# EAGLE design CCM_0011 (EAGLE 8.6.0)

## Sheet 1 of 4: stage A
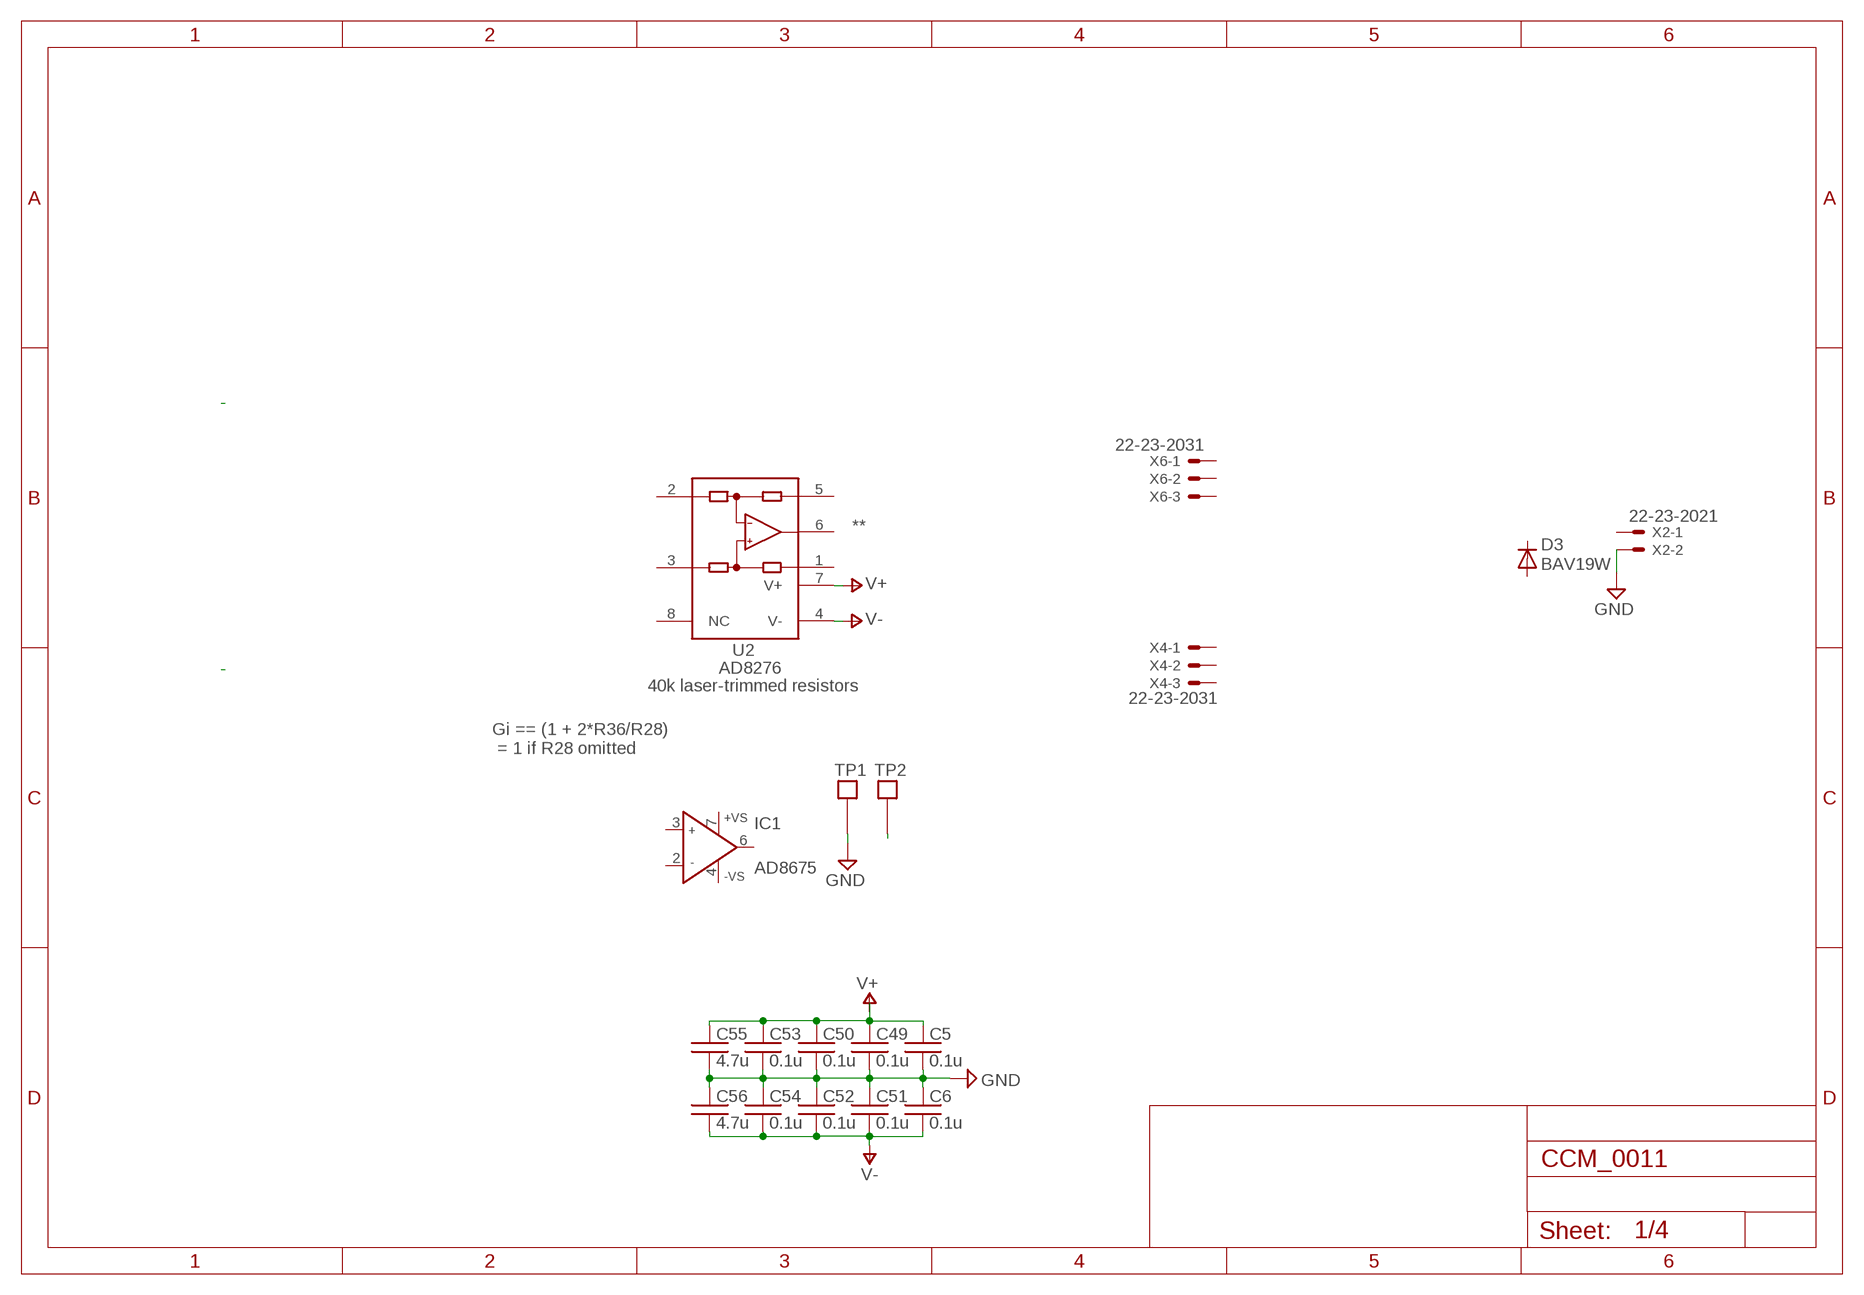
[diagram p0: schematic, sheet 1]

### Parts
C5  0.1u  C0603  [0603]
C6  0.1u  C0603  [0603]
C49  0.1u  C0603  [0603]
C50  0.1u  C0603  [0603]
C51  0.1u  C0603  [0603]
C52  0.1u  C0603  [0603]
C53  0.1u  C0603  [0603]
C54  0.1u  C0603  [0603]
C55  4.7u  C0603  [0603]
C56  4.7u  C0603  [0603]
D3  BAV19W  DIODE-SOD123  [SOD123]
IC1  AD8675  AD825_A  [SO08]
TP1  TESTPOINT  [TESTPOINT]
TP2  TESTPOINT  [TESTPOINT]
U2  AD8276  [SO8]
X2  22-23-2021  [22-23-2021]
X4  22-23-2031  [22-23-2031]
X6  22-23-2031  [22-23-2031]

### Nets
GND: C5.2 C6.1 C49.2 C50.2 C51.1 C52.1 C53.2 C54.1 C55.2 C56.1 TP1.P$1 X2.2 ; also sheet 2,4
N$7: TP2.P$1
V+: C5.1 C49.1 C50.1 C53.1 C55.1 U2.7(V+) ; also sheet 2,3
V-: C6.2 C51.2 C52.2 C54.2 C56.2 U2.4(V-) ; also sheet 2,3
Unconnected: D3.A D3.C IC1.2(IN-) IC1.3(IN+) IC1.4(-VS) IC1.6(OUT) IC1.7(+VS) U2.1(REF) U2.2(-IN) U2.3(+IN) U2.5(SENSE) U2.6(OUT) U2.8(NC) X2.1 X4.1 X4.2 X4.3 X6.1 X6.2 X6.3

### Notes on the sheet
- **
- 40k laser-trimmed resistors
- Gi == (1 + 2*R36/R28)
   = 1 if R28 omitted

## Sheet 2 of 4: triangle wave generation
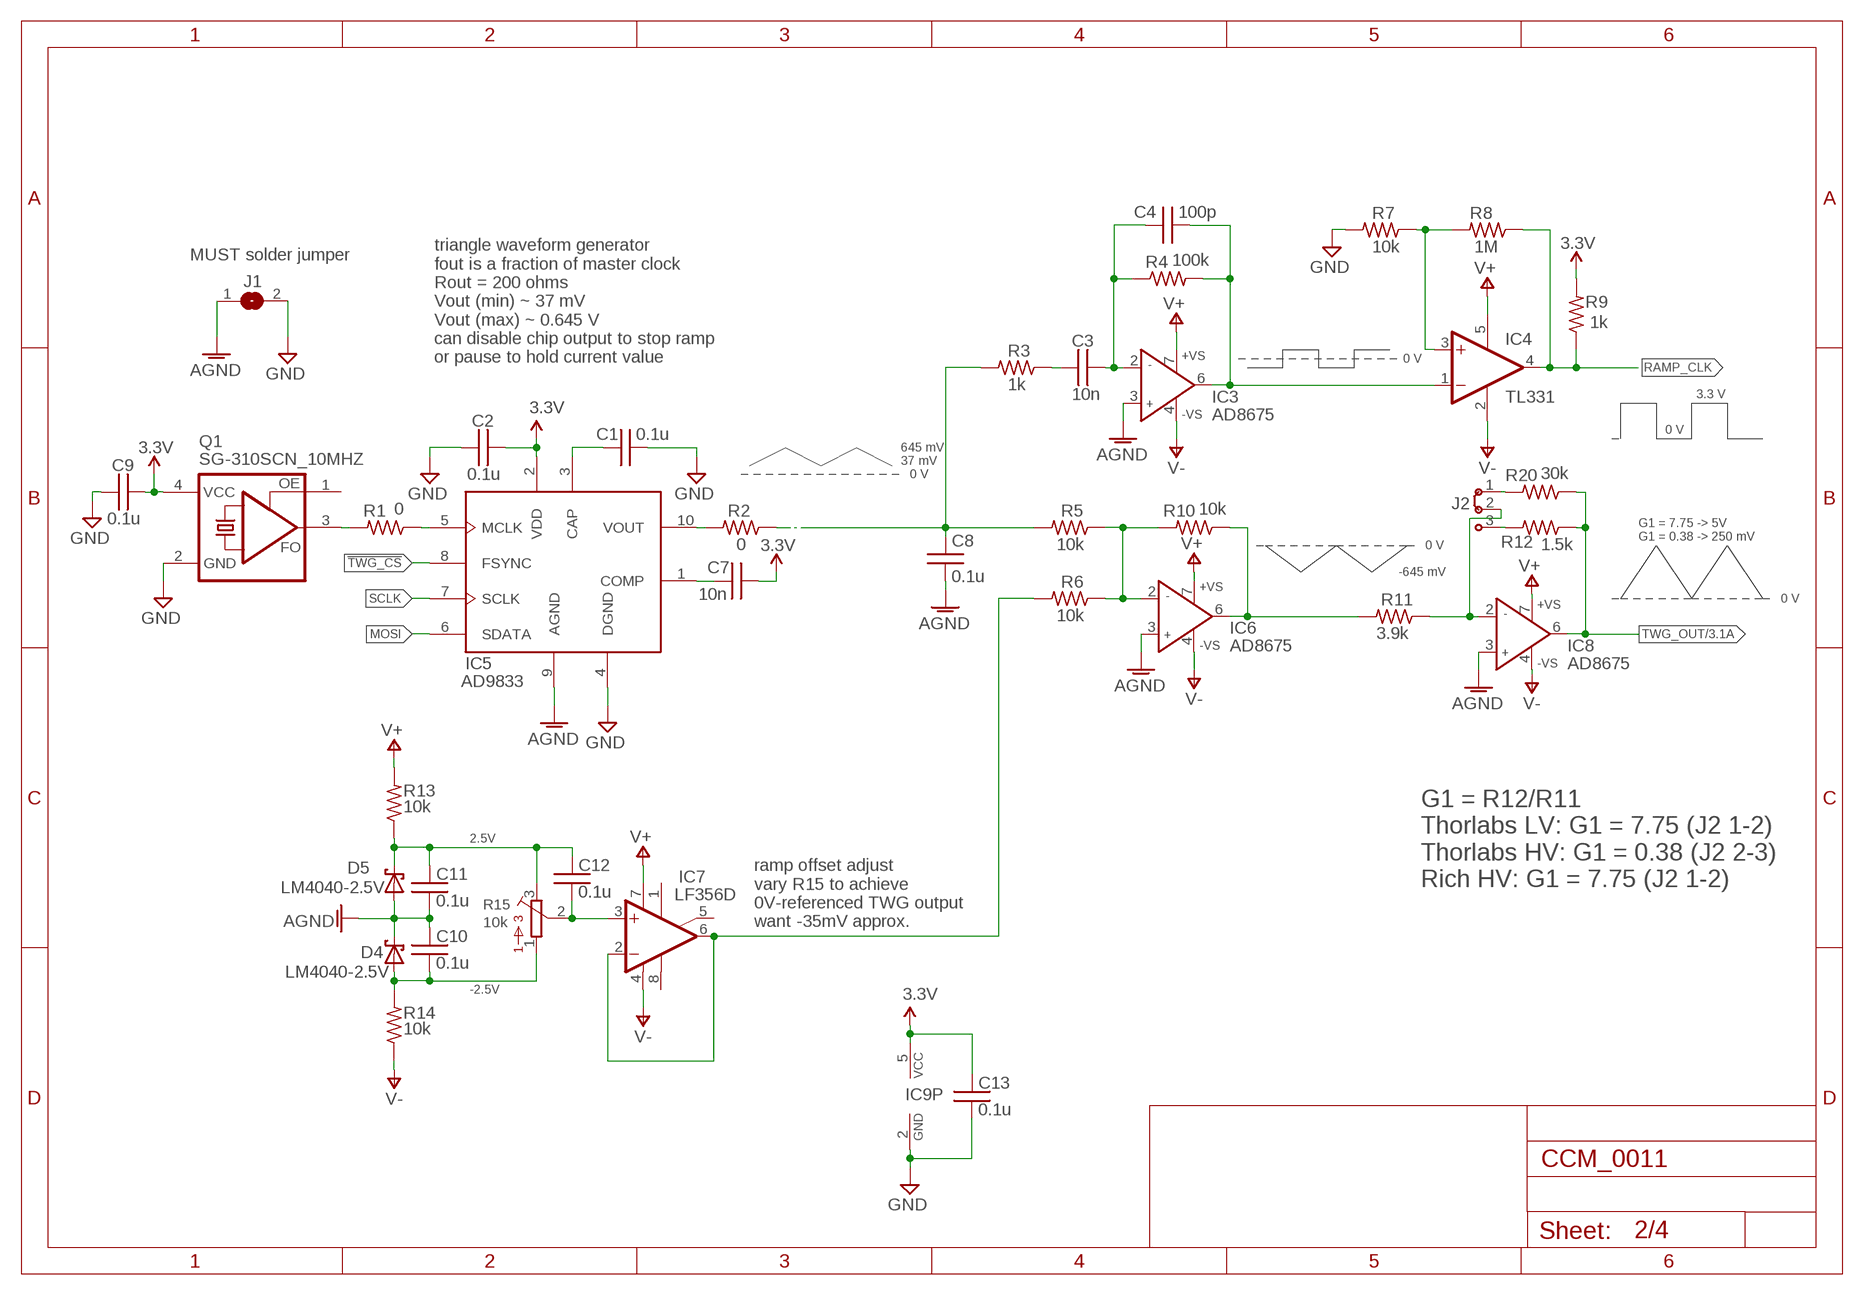
[diagram p1: schematic, sheet 2]

### Parts
C1  0.1u  C0603  [0603]
C2  0.1u  C0603  [0603]
C3  10n  C0603  [0603]
C4  100p  C0603  [0603]
C7  10n  C0603  [0603]
C8  0.1u  C0603  [0603]
C9  0.1u  C0603  [0603]
C10  0.1u  C0603  [0603]
C11  0.1u  C0603  [0603]
C12  0.1u  C0603  [0603]
C13  0.1u  C0603  [0603]
D4  LM4040-2.5V  LM4040  [SOT23]
D5  LM4040-2.5V  LM4040  [SOT23]
IC3  AD8675  AD825_BR  [SO8]
IC4  TL331  [DBV-R-PDSO-G5]
IC5  AD9833  AD9833/7  [MSOP10]
IC6  AD8675  AD825_BR  [SO8]
IC7  LF356D  [SO08]
IC8  AD8675  AD825_BR  [SO8]
IC9  741G3157DBVR  [DBV_R-PDSO-G6]
J1  SJ  [SJ]
J2  J2X2MM  [04C]
Q1  SG-310SCN_10MHZ  ASF1  [ASF]
R1  0  R0603  [0603]
R2  0  R0603  [0603]
R3  1k  R0603  [0603]
R4  100k  R0603  [0603]
R5  10k  R0603  [0603]
R6  10k  R0603  [0603]
R7  10k  R0603  [0603]
R8  1M  R0603  [0603]
R9  1k  R0603  [0603]
R10  10k  R0603  [0603]
R11  3.9k  R0603  [0603]
R12  1.5k  R0603  [0603]
R13  10k  R0603  [0603]
R14  10k  R0603  [0603]
R15  10k  3386-H  [3386H]
R20  30k  R0603  [0603]

### Nets
3.3V: C2.1 C7.1 C9.1 C13.1 IC5.2(VDD) IC9.5(VCC) Q1.4(VCC) R9.2 ; also sheet 4
!TWG_CS: IC5.8(FSYNC)
AGND: C8.2 C10.1 C11.2 D4.1(C) D5.2(A) IC3.3(IN+) IC5.9(AGND) IC6.3(IN+) IC8.3(IN+) J1.1 ; also sheet 3,4
GND: C1.1 C2.2 C9.2 C13.2 IC5.4(DGND) IC9.2(GND) J1.2 Q1.2(GND) R7.2 ; also sheet 1,4
MOSI: IC5.6(SDATA)
N$3: IC5.10(VOUT) R2.2
N$6: IC4.3(+IN) R7.1 R8.2
N$9: C1.2 IC5.3(CAP)
N$10: C3.1 R3.1
N$11: C3.2 C4.2 IC3.2(IN-) R4.1
N$12: C4.1 IC3.6(OUT) IC4.1(-IN) R4.2
N$13: C10.2 D4.2(A) R14.2 R15.1
N$14: C12.2 IC7.3(+IN) R15.2
N$15: IC7.2(-IN) IC7.6(OUT) R6.2
N$16: IC6.2(IN-) R5.1 R6.1 R10.2
N$17: IC8.2(IN-) J2.2 R11.1
N$18: C11.1 C12.1 D5.1(C) R13.1 R15.3
N$19: IC6.6(OUT) R10.1 R11.2
N$23: Q1.3(FO) R1.2
N$24: C7.2 IC5.1(COMP)
N$26: IC5.5(MCLK) R1.1
N$28: J2.1 R20.2
N$29: J2.3 R12.2
RAMP_CLK: IC4.4(OUT) R8.1 R9.1
SCLK: IC5.7(SCLK)
TWG_OUT: IC8.6(OUT) R12.1 R20.1 ; also sheet 3
TWG_RAW: C8.1 R2.1 R3.2 R5.2
V+: IC3.7(+VS) IC4.5(V+) IC6.7(+VS) IC7.7(V+) IC8.7(+VS) R13.2 ; also sheet 1,3
V-: IC3.4(-VS) IC4.2(GND) IC6.4(-VS) IC7.4(V-) IC8.4(-VS) R14.1 ; also sheet 1,3
Unconnected: IC7.1(ON1) IC7.5(ON2) IC7.8(OPT) IC9.1(B) IC9.3(A) IC9.4(X) IC9.6(!A!/B) Q1.1(OE)

### Notes on the sheet
- MUST solder jumper
- triangle waveform generator
  fout is a fraction of master clock
  Rout = 200 ohms
  Vout (min) ~ 37 mV
  Vout (max) ~ 0.645 V
  can disable chip output to stop ramp
  or pause to hold current value
- 0 V
- 3.3 V
- 0 V
- 645 mV
- 37 mV
- 0 V
- G1 = 7.75 -> 5V
  G1 = 0.38 -> 250 mV
- 0 V
- -645 mV
- 0 V
- 2.5V
- G1 = R12/R11
  Thorlabs LV: G1 = 7.75 (J2 1-2)
  Thorlabs HV: G1 = 0.38 (J2 2-3)
  Rich HV: G1 = 7.75 (J2 1-2)
- ramp offset adjust
  vary R15 to achieve 
  0V-referenced TWG output
  want -35mV approx.
- -2.5V

## Sheet 3 of 4: cavity drive
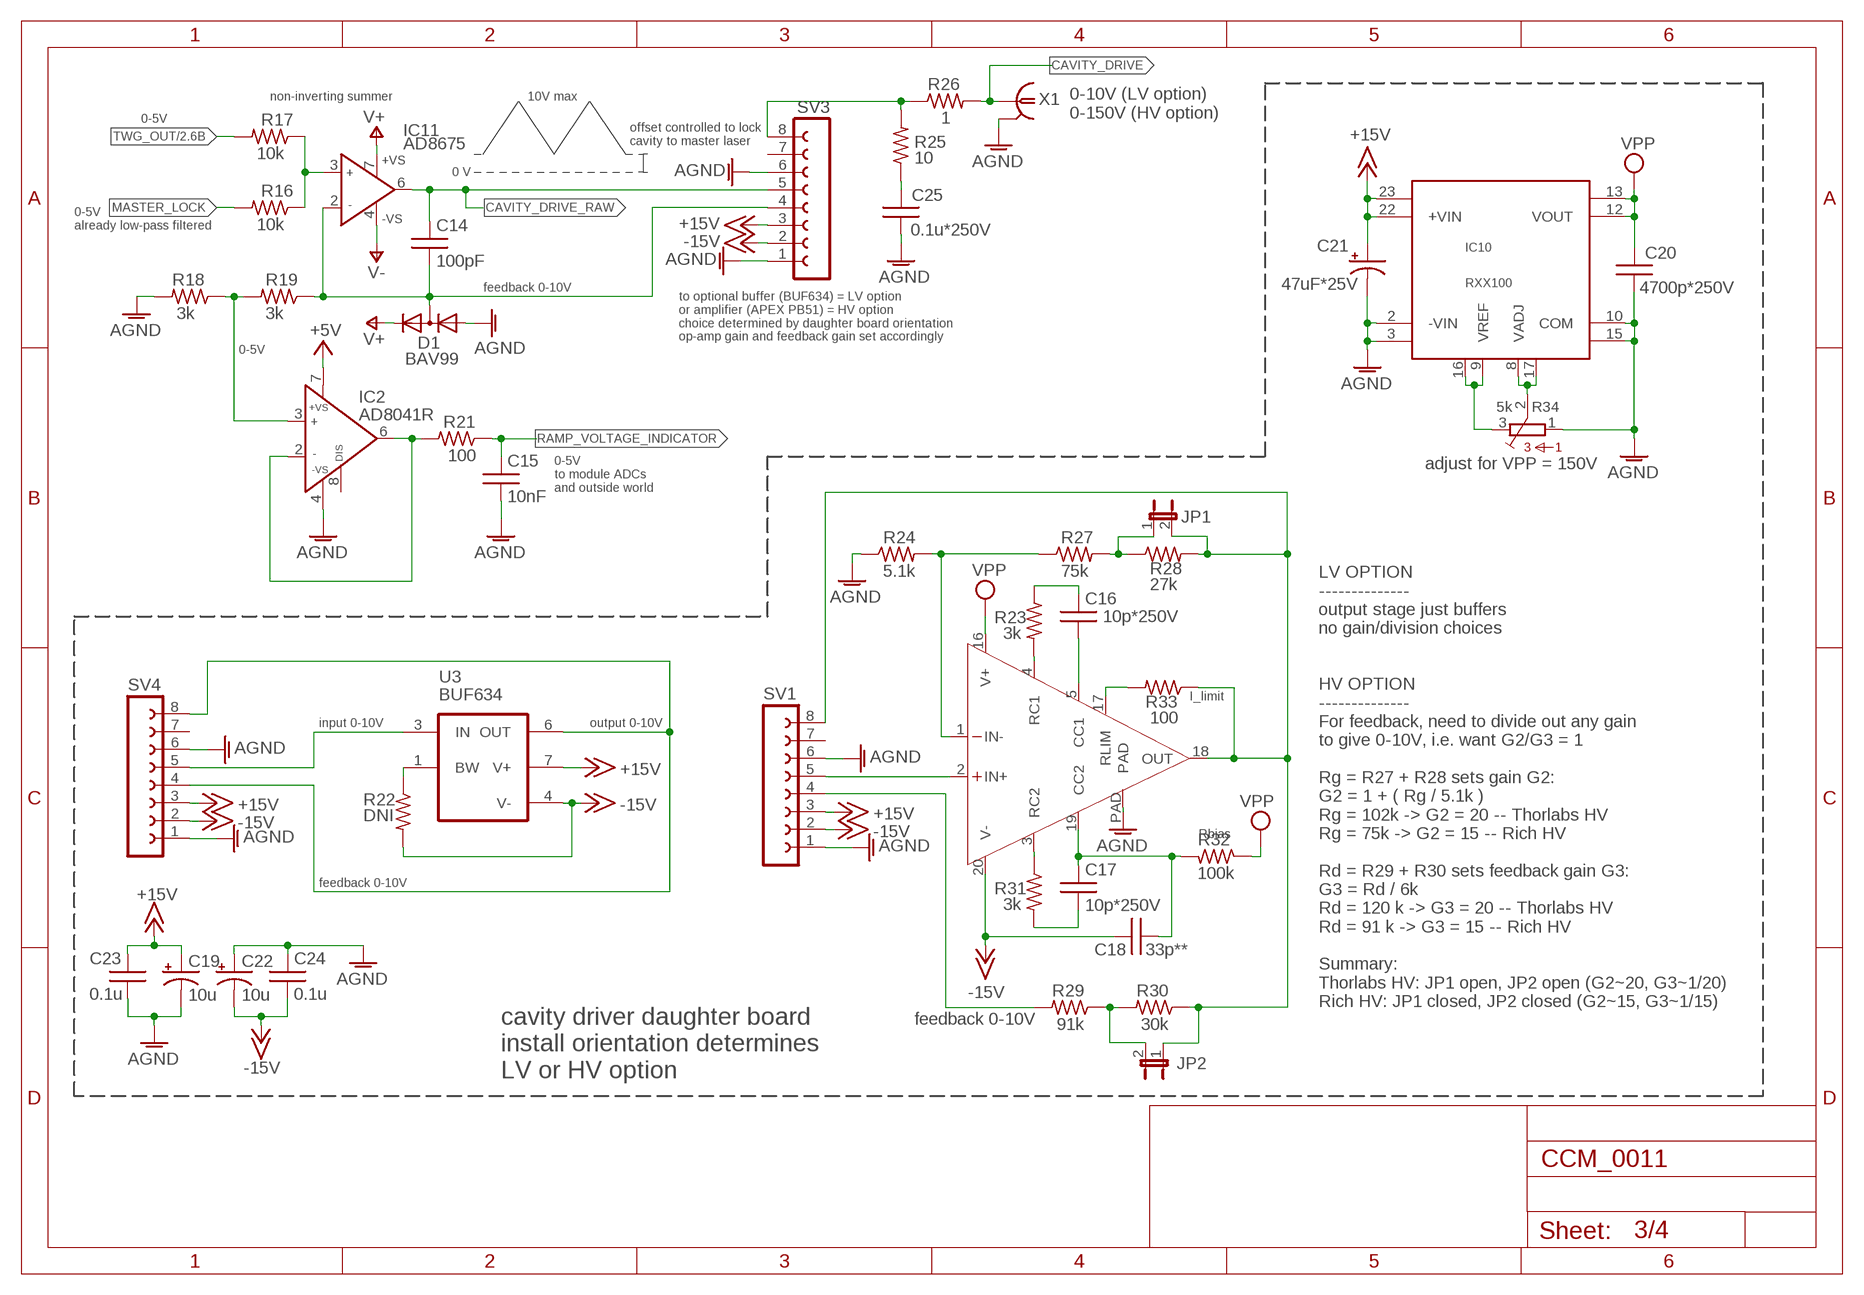
[diagram p2: schematic, sheet 3]

### Parts
C14  100pF  C0603  [0603]
C15  10nF  C0603  [0603]
C16  10p*250V  C0603  [0603]
C17  10p*250V  C0603  [0603]
C18  33p**  C0603  [0603]
C19  10u  CAP_POL1206  [EIA3216]
C20  4700p*250V  CAPACITOR1210  [1210]
C21  47uF*25V  CAP_POL7343  [EIA7343]
C22  10u  CAP_POL1206  [EIA3216]
C23  0.1u  C0603  [0603]
C24  0.1u  C0603  [0603]
C25  0.1u*250V  CAPACITOR1210  [1210]
D1  BAV99  [SOT23]
IC2  AD8041R  [SO8]
IC10  RXX100  [RXXDIP]
IC11  AD8675  AD825_A  [SO08]
JP1  JP1E  [JP1]
JP2  JP1E  [JP1]
R16  10k  R0603  [0603]
R17  10k  R0603  [0603]
R18  3k  R0603  [0603]
R19  3k  R0603  [0603]
R21  100  R0603  [0603]
R22  DNI  R0603  [0603]
R23  3k  R0603  [0603]
R24  5.1k  R0603  [0603]
R25  10  RESISTOR2512  [2512]
R26  1  RESISTOR2512  [2512]
R27  75k  R0603  [0603]
R28  27k  R0603  [0603]
R29  91k  R0603  [0603]
R30  30k  R0603  [0603]
R31  3k  R0603  [0603]
R32  100k  R0603  [0603]
R33  100  R0603  [0603]
R34  5k  3386-H  [3386H]
SV1  FE08W  [FE08W]
SV3  FE08-1  [FE08]
SV4  FE08W  [FE08W]
U3  BUF634  [SO8]
U$1  PA78  [PSOP-20]
X1  1-227161-0  [AMP_227161]

### Nets
+5V: IC2.7(+VS) ; also sheet 4
+15V: C19.A(+) C21.A(+) C23.1 IC10.22(+VIN) IC10.23(VIN2+) SV1.3 SV3.3 SV4.3 U3.7(V+)
-15V: C18.2 C22.C(-) C24.2 R22.2 SV1.2 SV3.2 SV4.2 U3.4(V-) U$1.20(V-)
AGND: C15.2 C19.C(-) C20.2 C21.C(-) C22.A(+) C23.2 C24.1 C25.2 D1.1(A) IC2.4(-VS) IC10.2(-VIN) IC10.3(VIN2-) IC10.10(COM) IC10.15(COM2) R18.2 R24.1 R34.1 SV1.1 SV1.6 SV3.1 SV3.6 SV4.1 SV4.6 U$1.PAD X1.2 ; also sheet 2,4
CAVITY_DRIVE: R26.2 X1.1
CAVITY_DRIVE_RAW: C14.1 IC11.6(OUT) SV3.5
MASTER_LOCK: R16.2
N$2: SV4.5 U3.3(IN)
N$5: IC2.3(IN+) R18.1 R19.2
N$8: JP2.2 R29.1 R30.2
N$20: C14.2 D1.3(AC) IC11.2(IN-) R19.1 SV3.4
N$21: IC11.3(IN+) R16.1 R17.1
N$22: R22.1 U3.1(BW)
N$25: SV4.4 SV4.8 U3.6(OUT)
N$27: SV1.5 U$1.2(IN+)
N$30: IC2.2(IN-) IC2.6(OUT) R21.2
N$31: C16.1 R23.1
N$32: JP1.2 JP2.1 R28.2 R30.1 R33.1 SV1.8 U$1.18(OUT)
N$33: R25.2 R26.1 SV3.8
N$34: C25.1 R25.1
N$35: R33.2 U$1.17(RLIM)
N$36: JP1.1 R27.2 R28.1
N$37: R23.2 U$1.4(RC1)
N$38: R24.2 R27.1 U$1.1(IN-)
N$39: C16.2 U$1.5(CC1)
N$40: R29.2 SV1.4
N$42: R31.1 U$1.3(RC2)
N$43: C17.1 C18.1 R32.2 U$1.19(CC2)
N$44: C17.2 R31.2
N$45: IC10.9(VREF) IC10.16(VREF2) R34.3
N$46: IC10.8(VADJ) IC10.17(VADJ2) R34.2
RAMP_VOLTAGE_INDICATOR: C15.1 R21.1
TWG_OUT: R17.2 ; also sheet 2
V+: D1.2(C) IC11.7(+VS) ; also sheet 1,2
V-: IC11.4(-VS) ; also sheet 1,2
VOUT2: C20.1 IC10.12(VOUT) IC10.13(VOUT2) ; supply symbol labelled VPP
VPP: R32.1 U$1.16(V+)
Unconnected: IC2.8(DISABLE) SV1.7 SV3.7 SV4.7

### Notes on the sheet
- non-inverting summer | 10V max
- 0-10V (LV option)
  0-150V (HV option)
- 0-5V
- offset controlled to lock 
  cavity to master laser
- 0 V
- 0-5V
  already low-pass filtered
- feedback 0-10V
- to optional buffer (BUF634) = LV option
  or amplifier (APEX PB51) = HV option
  choice determined by daughter board orientation
  op-amp gain and feedback gain set accordingly
- 0-5V
- adjust for VPP = 150V
- 0-5V
  to module ADCs
  and outside world
- I_limit
- input 0-10V | output 0-10V
- Rbias
- feedback 0-10V
- LV OPTION
  --------------
  output stage just buffers
  no gain/division choices
  
  
  HV OPTION
  --------------
  For feedback, need to divide out any gain
  to give 0-10V, i.e. want G2/G3 = 1
  
  Rg = R27 + R28 sets gain G2: 
  G2 = 1 + ( Rg / 5.1k )
  Rg = 102k -> G2 = 20 -- Thorlabs HV
  Rg = 75k -> G2 = 15 -- Rich HV
  
  Rd = R29 + R30 sets feedback gain G3:
  G3 = Rd / 6k
  Rd = 120 k -> G3 = 20 -- Thorlabs HV
  Rd = 91 k -> G3 = 15 -- Rich HV
  
  Summary:
  Thorlabs HV: JP1 open, JP2 open (G2~20, G3~1/20)
  Rich HV: JP1 closed, JP2 closed (G2~15, G3~1/15)
- feedback 0-10V
- cavity driver daughter board
  install orientation determines
  LV or HV option

## Sheet 4 of 4: master input stage
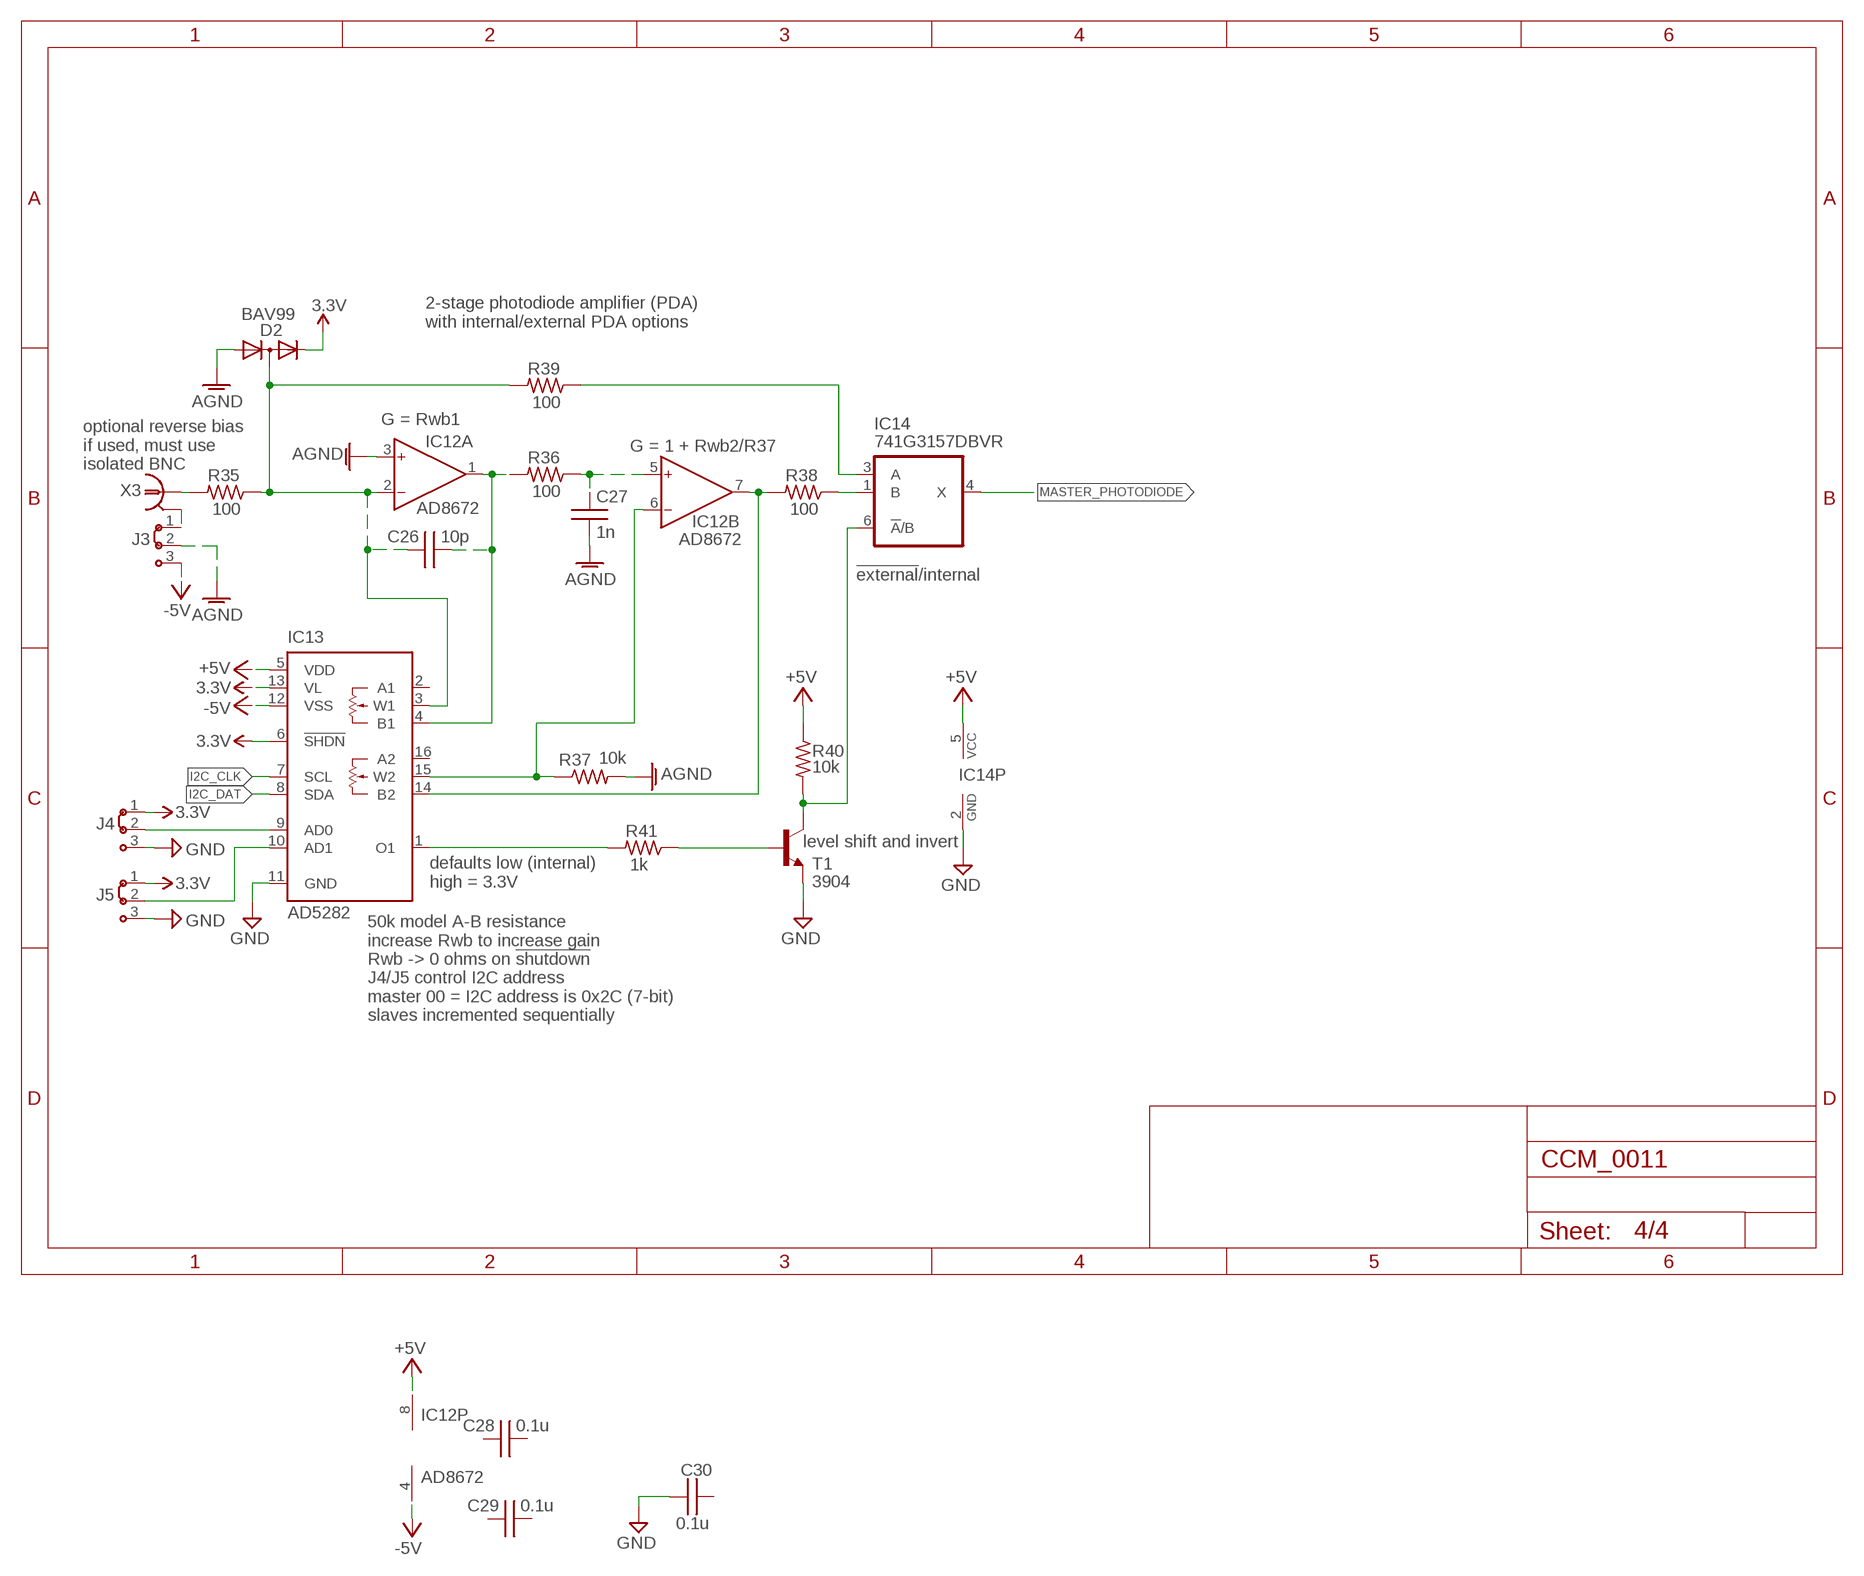
[diagram p3: schematic, sheet 4]

### Parts
C26  10p  C0603  [0603]
C27  1n  C0603  [0603]
C28  0.1u  C0603  [0603]
C29  0.1u  C0603  [0603]
C30  0.1u  C0603  [0603]
D2  BAV99  [SOT23]
IC12  AD8672  AD8599R  [SO8]
IC13  AD5282  [TSSOP16]
IC14  741G3157DBVR  [DBV_R-PDSO-G6]
J3  J2X2MM  [04C]
J4  J2X2MM  [04C]
J5  J2X2MM  [04C]
R35  100  R0603  [0603]
R36  100  R0603  [0603]
R37  10k  R0603  [0603]
R38  100  R0603  [0603]
R39  100  R0603  [0603]
R40  10k  R0603  [0603]
R41  1k  R0603  [0603]
T1  3904  MMBT3904LT1-NPN-SOT23-BEC  [SOT23-BEC]
X3  1-227161-0  [AMP_227161]

### Nets
3.3V: D2.2(C) IC13.6(!SHDN) IC13.13(VL) J4.1 J5.1 ; also sheet 2
+5V: IC12.8(P:V+) IC13.5(VDD) IC14.5(VCC) R40.1 ; also sheet 3
-5V: IC12.4(P:V-) IC13.12(VSS) J3.3
AGND: C27.2 D2.1(A) IC12.3(A:IN+) J3.2 R37.2 ; also sheet 2,3
GND: C30.2 IC13.11(GND) IC14.2(GND) J4.3 J5.3 T1.E ; also sheet 1,2
I2C_CLK: IC13.7(SCL)
I2C_DAT: IC13.8(SDA)
MASTER_PHOTODIODE: IC14.4(X)
N$41: IC12.7(B:OUT) IC13.14(B2) R38.2
N$47: J3.1 X3.2
N$48: C26.1 D2.3(AC) IC12.2(A:IN-) IC13.3(W1) R35.1 R39.2
N$49: IC12.6(B:IN-) IC13.15(W2) R37.1
N$50: R41.1 T1.B
N$51: IC14.1(B) R38.1
N$52: C27.1 IC12.5(B:IN+) R36.1
N$53: C26.2 IC12.1(A:OUT) IC13.4(B1) R36.2
N$54: IC14.3(A) R39.1
N$55: IC14.6(!A!/B) R40.2 T1.C
N$56: IC13.1(O1) R41.2
N$57: R35.2 X3.1
N$58: IC13.10(AD1) J5.2
N$59: IC13.9(AD0) J4.2
Unconnected: C28.1 C28.2 C29.1 C29.2 C30.1 IC13.2(A1) IC13.16(A2)

### Notes on the sheet
- 2-stage photodiode amplifier (PDA)
  with internal/external PDA options
- G = Rwb1
- G = 1 + Rwb2/R37
- optional reverse bias
  if used, must use 
  isolated BNC
- !external!/internal
- level shift and invert
- defaults low (internal)
  high = 3.3V
- 50k model A-B resistance
  increase Rwb to increase gain
  Rwb -> 0 ohms on !shutdown!
  J4/J5 control I2C address
  master 00 = I2C address is 0x2C (7-bit)
  slaves incremented sequentially

## Library data of the parts
C1-C18 C23 C24 C26-C30 C49-C56 = acrooptics:C: Capacitor
C19 C21 C22 = acrooptics:CAP_POL: Capacitor Polarized These are standard SMD and PTH capacitors. Normally 10uF, 47uF, and 100uF in electrolytic and tantalum varieties. Always verify the external diameter of the through hole cap, it varies with capacity, voltage, and manufacturer. The EIA devices should be standard.
C20 C25 = noah:CAPACITOR
D1 D2 = custom_parts:BAV99: 200mA 70V High Conductance Ultra-fast Switching Diode
D3 = AquariumLibrary:DIODE-: DIODE
D4 D5 = noah:LM4040: LM4040 Reference Zener Diode
IC1 IC11 = noah:AD825_A: Low Cost, General-Purpose High Speed JFET Amplifier Source: http://www.analog.com/static/imported-files/data_sheets/AD825.pdf
IC2 = analog-devices:AD8041: 160 MHz Rail-to-Rail Amplifier with Disable Source: http://www.analog.com/static/imported-files/data_sheets/AD8041.pdf; MF: ALTERA CORPORATION; MPN: AD8041ARZ; OC_FARNELL: 1464831; OC_NEWARK: 88H0130
IC3 IC6 IC8 = noah:AD825_B: Low Cost, General-Purpose High Speed JFET Amplifier Source: http://www.analog.com/static/imported-files/data_sheets/AD825.pdf; MF: ALTERA CORPORATION; MPN: AD825ARZ; OC_FARNELL: 9603735; OC_NEWARK: 59K6528
IC4 = linear:TL331: SINGLE DIFFERENTIAL COMPARATOR Source: Data sheet
IC5 = custom_parts:AD9833/7: Analog Devices DDS Waveform generator The AD9833 is 12.5MHz (25MHz clock) the AD9837 is 8MHz (16MHz clock) both have 10 bit DACs
IC7 = linear:LF356: OP AMP
IC9 IC14 = 74xx-little-de:74*1G3157: Single-Pole, Double-Throw Analog Switch Source: http://focus.ti.com/lit/ds/symlink/sn74lvc1g3157.pdf
IC10 = custom_parts:RXX100: Innoline Rxx-100_150B DC/DC converters
IC12 = analog-devices:AD8599: Single and Dual, Ultralow Distortion, Ultralow Noise Op Amps Source: http://www.analog.com/static/imported-files/data_sheets/AD8597_8599.pdf; MPN: AD8599ARZ; OC_FARNELL: 1438872; OC_NEWARK: 34M5072
IC13 = analog-devices:AD5282: Dual +15 V/±5 V, 256-Position, I2C-Compatible Digital Potentiometer Source: http://www.analog.com/static/imported-files/data_sheets/AD5280_5282.pdf; MF: ALTERA CORPORATION; MPN: AD5282BRUZ50; OC_FARNELL: 1438442; OC_NEWARK: 59K3850
J1 = acrooptics:SJ: SMD solder JUMPER
J2-J5 = jumper:J2: Jumper switch 2 x 2.5 mm
JP1 JP2 = jumper:JP1E: JUMPER
Q1 = crystal:ASF*: CRYSTAL CLOCK OSCILLATORS 5.0 Vdc or 3.3 Vdc - LOW PROFILE ULTRA MINIATURE CERAMIC SURFACE MOUNT Source: http://www.abracon.com/Oscillators/asf1-L-L1.pdf; OC_FARNELL: unknown; OC_NEWARK: unknown
R1-R14 R16-R24 R27-R33 R35-R41 = acrooptics:R: 0603 resistor
R15 R34 = bourns:3386-: 3386 Series 3/8" Square Trimmer
R25 R26 = noah:RESISTOR: RESISTOR, American symbol
SV1 SV4 = con-lsta:FE08W: FEMALE HEADER; OC_FARNELL: unknown; OC_NEWARK: unknown
SV3 = con-lsta:FE08-1: FEMALE HEADER; OC_FARNELL: unknown; OC_NEWARK: unknown
T1 = transistor-neu-to92:*-NPN-: NPN Transistror
TP1 TP2 = Fitch:TESTPOINT
U2 = noah:AD8276: Precision Unity Gain Diff. Amplifier
U3 = noah:BUF634: 250mA High-Speed Buffer
U$1 = noah:PA78
X1 X3 = con-coax:?227161*: JACK, RIGHT ANGLE, 50 OHM, PCB, BNC Source: amp_227161.pdf; MF: TYCO ELECTRONICS; MPN: 1-227161; OC_FARNELL: unknown; OC_NEWARK: 33B3200
X2 = con-molex:22-23-2021: .100" (2.54mm) Center Header - 2 Pin; MF: MOLEX; MPN: 22-23-2021; OC_FARNELL: 1462926; OC_NEWARK: 25C3832
X4 X6 = con-molex:22-23-2031: .100" (2.54mm) Center Header - 3 Pin; MF: MOLEX; MPN: 22-23-2031; OC_FARNELL: 1462950; OC_NEWARK: 30C0862

## Net classes
1 standard: width 0.61 mm, clearance 0.254 mm

## Board
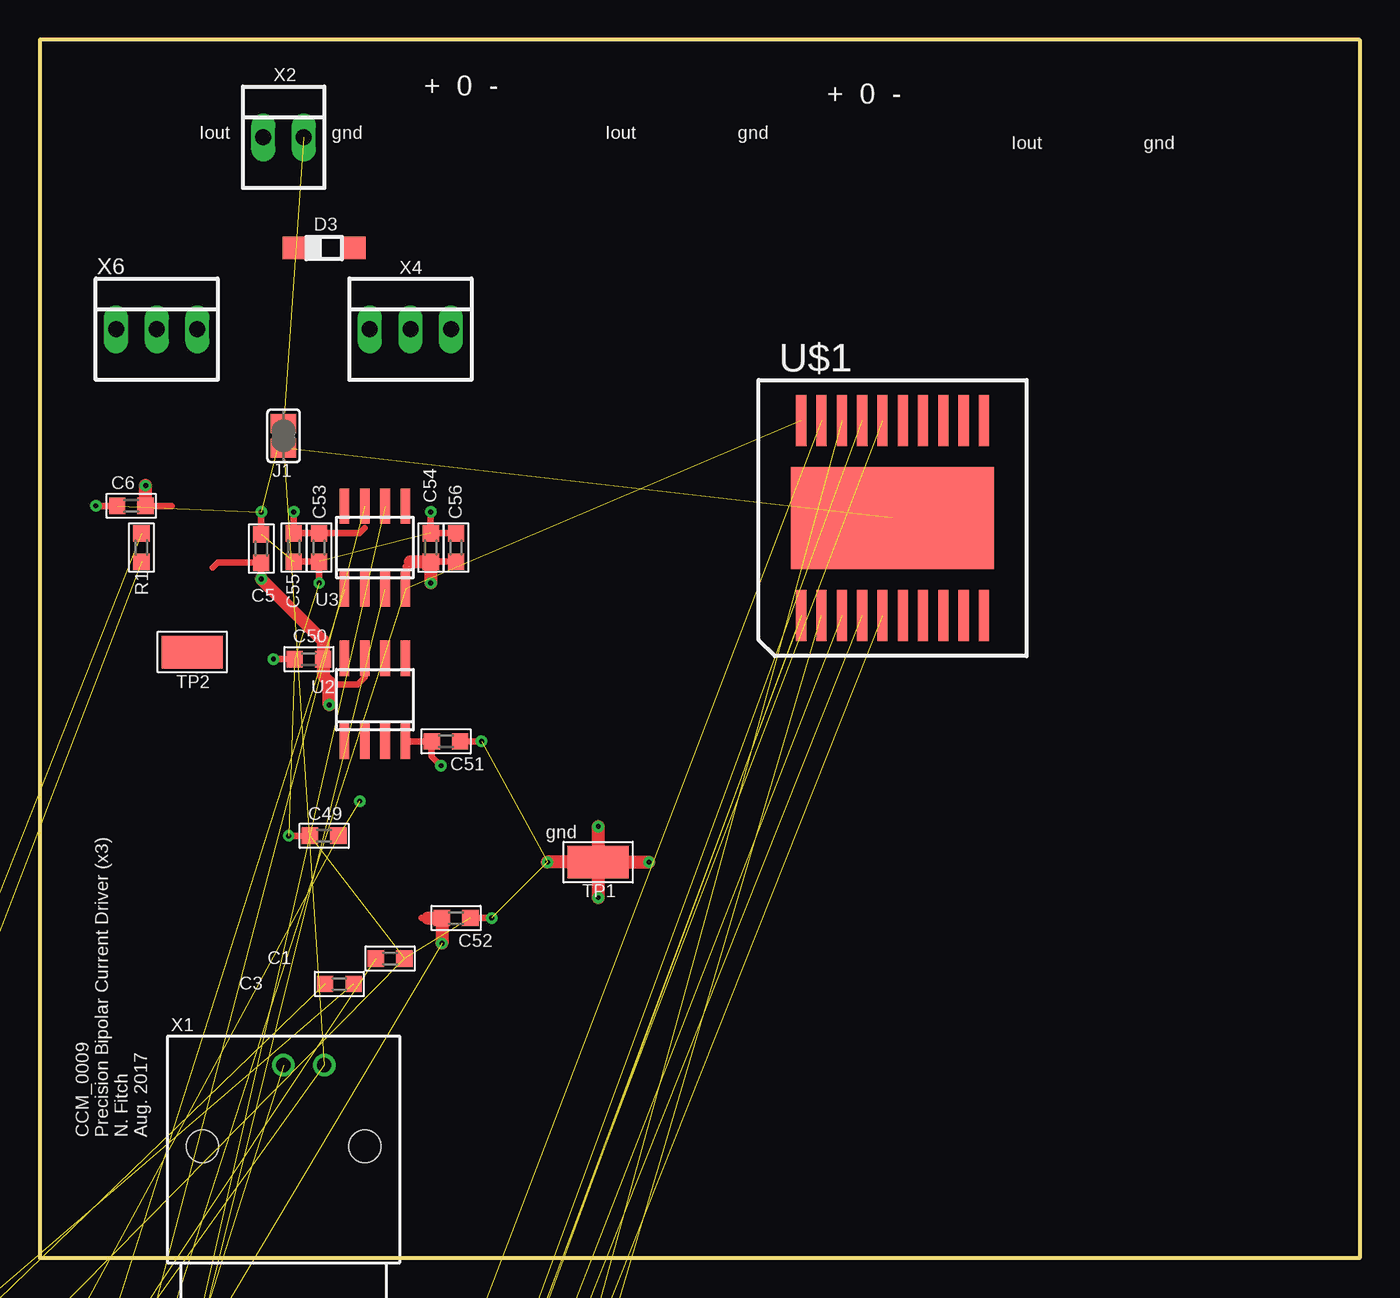
[diagram p4: board, top side]
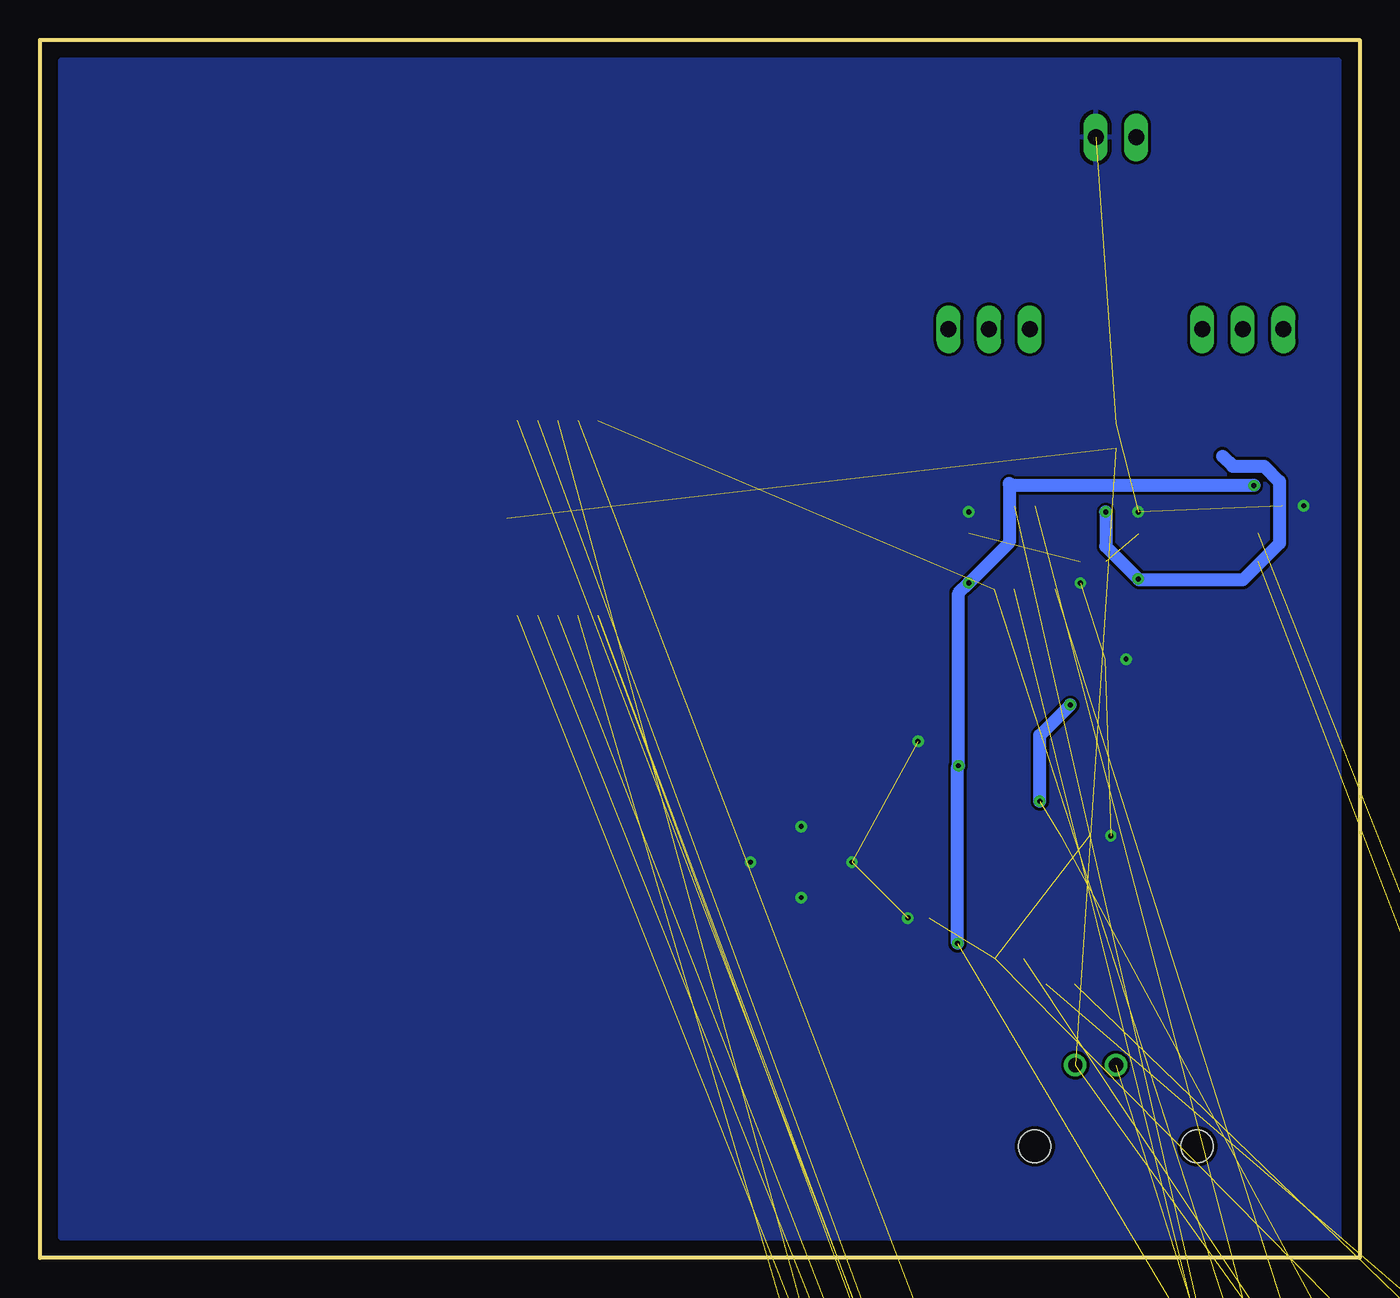
[diagram p5: board, bottom side, seen from below]

Size 82.55 x 76.2 mm. Coordinates in mm from the lower left corner, seen from the top.
Outline: 0,0 82.55,0 82.55,76.2 0,76.2 0,0
Copper layers (1*16): Top 0.035mm / dielectric 1.5mm / Bottom 0.035mm
Design rules "default *": minimum track width 10mil, minimum drill 10mil, track to track 7mil, track to pad 7mil, pad to pad 7mil, via to via 7mil, smd to smd 7mil, copper to edge 10mil, drill to drill 8mil, minimum pad ring 10mil, minimum via ring 8mil, stop-mask expansion 4mil, vias tented up to drill 0mil, thermal gap 10mil

### Footprints (pad centres in the part's own frame; a part is rotated, then mirrored left to right if it is on the bottom)
0603 = smd 1.016 x 1.016: 1 -0.889,0; 2 0.889,0
EIA3216 = smd 1.4 x 1.6: A 1.4,0; C -1.4,0
1210 = smd 1.016 x 2.54: 1 -1.651,0; 2 1.651,0
EIA7343 = smd 2.55 x 2.7: A 3.17,0; C -3.17,0
SOT23 = smd 1 x 1.4: 1 -0.95,-1.1; 2 0.95,-1.1; 3 0,1.1
SOD123 = smd 1.4 x 1.4: A 1.9,0; C -1.9,0
SO08 = smd 0.61 x 2.21: 1 -1.905,-2.616; 2 -0.635,-2.616; 3 0.635,-2.616; 4 1.905,-2.616; 5 1.905,2.616; 6 0.635,2.616; 7 -0.635,2.616; 8 -1.905,2.616
SO8 = smd 0.6 x 2.2: 1 -1.905,-2.6; 2 -0.635,-2.6; 3 0.635,-2.6; 4 1.905,-2.6; 5 1.905,2.6; 6 0.635,2.6; 7 -0.635,2.6; 8 -1.905,2.6
DBV-R-PDSO-G5 = smd 0.6 x 1.2: 1 -0.95,-1.306; 2 0,-1.306; 3 0.95,-1.306; 4 0.95,1.306; 5 -0.95,1.306
MSOP10 = smd 0.25 x 1: 1 -1,-2.113; 2 -0.5,-2.113; 3 0,-2.113; 4 0.5,-2.113; 5 1,-2.113; 6 1,2.113; 7 0.5,2.113; 8 0,2.113; 9 -0.5,2.113; 10 -1,2.113
SO08' = smd 0.6 x 2.2: 1 -1.905,-2.6; 2 -0.635,-2.6; 3 0.635,-2.6; 4 1.905,-2.6; 5 1.905,2.6; 6 0.635,2.6; 7 -0.635,2.6; 8 -1.905,2.6
DBV_R-PDSO-G6 = smd 0.69 x 0.99: 1 -0.95,-1.29; 2 0,-1.29; 3 0.95,-1.29; 4 0.95,1.3; 5 0,1.3; 6 -0.95,1.3
RXXDIP = drill 1 octagon: 2 -12.7,-7.62; 3 -10.16,-7.62; 8 2.54,-7.62; 9 5.08,-7.62; 10 7.62,-7.62; 12 12.7,-7.62; 13 12.7,7.62; 15 7.62,7.62; 16 5.08,7.62; 17 2.54,7.62; 22 -10.16,7.62; 23 -12.7,7.62
TSSOP16 = smd 0.9 x 0.35: 1 -2.875,2.275; 2 -2.875,1.625; 3 -2.875,0.975; 4 -2.875,0.325; 5 -2.875,-0.325; 6 -2.875,-0.975; 7 -2.875,-1.625; 8 -2.875,-2.275; 9 2.875,-2.275; 10 2.875,-1.625; 11 2.875,-0.975; 12 2.875,-0.325; 13 2.875,0.325; 14 2.875,0.975; 15 2.875,1.625; 16 2.875,2.275
SJ = smd 1.168 x 1.6: 1 -0.762,0; 2 0.762,0
04C = drill 0.813 pad 1.905 octagon: 1 -1.905,0; 2 1.905,0; 3 5.715,0
JP1 = drill 0.914 long: 1 0,-1.27; 2 0,1.27
ASF = smd 1.6 x 1.5: 1 -1.25,-1.15; 2 1.25,-1.15; 3 1.25,1.15; 4 -1.25,1.15
3386H = drill 0.813 pad 1.676 octagon: 1 -2.54,0.635; 2 0,-1.905; 3 2.54,0.635
2512 = smd 1.8 x 3.2: 1 -2.8,0; 2 2.8,0
FE08W = drill 0.813 long: 1 -8.89,0; 2 -6.35,0; 3 -3.81,0; 4 -1.27,0; 5 1.27,0; 6 3.81,0; 7 6.35,0; 8 8.89,0
FE08 = drill 0.813 long: 1 -8.89,0; 2 -6.35,0; 3 -3.81,0; 4 -1.27,0; 5 1.27,0; 6 3.81,0; 7 6.35,0; 8 8.89,0
SOT23-BEC = smd 1 x 1.4: B -0.95,-1.1; C 0,1.1; E 0.95,-1.1
TESTPOINT = smd 3.81 x 2.032: P$1 0,0
PSOP-20 = smd 0.635 x 3.175: 1 -5.715,-6.096; 2 -4.445,-6.096; 3 -3.175,-6.096; 4 -1.905,-6.096; 5 -0.635,-6.096; 6 0.635,-6.096; 7 1.905,-6.096; 8 3.175,-6.096; 9 4.445,-6.096; 10 5.715,-6.096; 11 5.715,6.096; 12 4.445,6.096; 13 3.175,6.096; 14 1.905,6.096; 15 0.635,6.096; 16 -0.635,6.096; 17 -1.905,6.096; 18 -3.175,6.096; 19 -4.445,6.096; 20 -5.715,6.096 | smd 12.7 x 6.35: PAD 0,0
AMP_227161 = drill 0.9 pad 1.27: 1 0,-5.08; 2 -2.54,-5.08 | hole 2: -5.08,0; 5.08,0
22-23-2021 = drill 1 long: 1 -1.27,0; 2 1.27,0
22-23-2031 = drill 1 long: 1 -2.54,0; 2 0,0; 3 2.54,0

### Placement (x,y rotation side)
C1  21.91,18.73 180 top
C2  not placed on the board
C3  18.73,17.14 180 top
C4  not placed on the board
C5  13.84,44.39 90 top
C6  5.71,47.05 0 top
C7  not placed on the board
C8  not placed on the board
C9  not placed on the board
C10  not placed on the board
C11  not placed on the board
C12  not placed on the board
C13  not placed on the board
C14  not placed on the board
C15  not placed on the board
C16  not placed on the board
C17  not placed on the board
C18  not placed on the board
C19  not placed on the board
C20  not placed on the board
C21  not placed on the board
C22  not placed on the board
C23  not placed on the board
C24  not placed on the board
C25  not placed on the board
C26  not placed on the board
C27  not placed on the board
C28  not placed on the board
C29  not placed on the board
C30  not placed on the board
C49  17.78,26.42 180 top
C50  16.83,37.47 180 top
C51  25.4,32.32 180 top
C52  26.04,21.27 180 top
C53  17.46,44.45 270 top
C54  24.45,44.45 270 top
C55  15.88,44.45 270 top
C56  26.04,44.45 270 top
D1  not placed on the board
D2  not placed on the board
D3  17.78,63.18 0 top
D4  not placed on the board
D5  not placed on the board
IC1  not placed on the board
IC2  not placed on the board
IC3  not placed on the board
IC4  not placed on the board
IC5  not placed on the board
IC6  not placed on the board
IC7  LF356D  [SO08']  not placed on the board
IC8  not placed on the board
IC9  not placed on the board
IC10  not placed on the board
IC11  not placed on the board
IC12  not placed on the board
IC13  not placed on the board
IC14  not placed on the board
J1  15.24,51.44 90 top
J2  not placed on the board
J3  not placed on the board
J4  not placed on the board
J5  not placed on the board
JP1  not placed on the board
JP2  not placed on the board
Q1  not placed on the board
R1  6.35,44.45 270 top
R2  not placed on the board
R3  not placed on the board
R4  not placed on the board
R5  not placed on the board
R6  not placed on the board
R7  not placed on the board
R8  not placed on the board
R9  not placed on the board
R10  not placed on the board
R11  not placed on the board
R12  not placed on the board
R13  not placed on the board
R14  not placed on the board
R15  not placed on the board
R16  not placed on the board
R17  not placed on the board
R18  not placed on the board
R19  not placed on the board
R20  not placed on the board
R21  not placed on the board
R22  not placed on the board
R23  not placed on the board
R24  not placed on the board
R25  not placed on the board
R26  not placed on the board
R27  not placed on the board
R28  not placed on the board
R29  not placed on the board
R30  not placed on the board
R31  not placed on the board
R32  not placed on the board
R33  not placed on the board
R34  not placed on the board
R35  not placed on the board
R36  not placed on the board
R37  not placed on the board
R38  not placed on the board
R39  not placed on the board
R40  not placed on the board
R41  not placed on the board
SV1  not placed on the board
SV3  not placed on the board
SV4  not placed on the board
T1  not placed on the board
TP1  34.92,24.77 0 top
TP2  9.53,37.91 0 top
U2  20.95,34.92 0 top
U3  20.95,44.45 0 top
U$1  53.34,46.29 0 top
X1  15.24,6.99 180 top
X2  15.24,70.1 0 top
X3  not placed on the board
X4  23.18,58.1 0 top
X6  7.3,58.1 0 top

### Tracks (layer width: path | path; a pad name or v marks a point on that pad's centre or on a via)
3.3V  (12 unrouted)
+5V  (4 unrouted)
+15V  (8 unrouted)
-5V  (2 unrouted)
-15V  (8 unrouted)
AGND  (39 unrouted)
CAVITY_DRIVE  (1 unrouted)
CAVITY_DRIVE_RAW  (2 unrouted)
GND  (via drill 0.3)  (24 unrouted)
  Top 0.406: C51.1 v27.62,32.32 | C55.2 C53.2 v17.46,42.23 | C56.1 C54.1 v24.45,46.67 | v15.56,26.42 C49.2 | C6.1 v3.49,47.05 | C5.2 v13.84,46.67 | C50.2 v14.61,37.47 | C52.1 v28.26,21.27
  Top 0.813: v34.92,26.99 TP1.P$1 | TP1.P$1 v31.75,24.77 | TP1.P$1 v38.1,24.77 | TP1.P$1 v34.92,22.54
  pour Bottom: 1.27,1.27 1.27,74.93 81.28,74.93 81.28,1.27
N$2  (1 unrouted)
N$3  (1 unrouted)
N$5  (2 unrouted)
N$6  (2 unrouted)
N$8  (2 unrouted)
N$9  (1 unrouted)
N$10  (1 unrouted)
N$11  (3 unrouted)
N$12  (3 unrouted)
N$13  (3 unrouted)
N$14  (2 unrouted)
N$15  (2 unrouted)
N$16  (3 unrouted)
N$17  (2 unrouted)
N$18  (4 unrouted)
N$19  (2 unrouted)
N$20  (4 unrouted)
N$21  (2 unrouted)
N$22  (1 unrouted)
N$23  (1 unrouted)
N$24  (1 unrouted)
N$25  (2 unrouted)
N$26  (1 unrouted)
N$27  (1 unrouted)
N$28  (1 unrouted)
N$29  (1 unrouted)
N$30  (2 unrouted)
N$31  (1 unrouted)
N$32  (6 unrouted)
N$33  (2 unrouted)
N$34  (1 unrouted)
N$35  (1 unrouted)
N$36  (2 unrouted)
N$37  (1 unrouted)
N$38  (2 unrouted)
N$39  (1 unrouted)
N$40  (1 unrouted)
N$41  (2 unrouted)
N$42  (1 unrouted)
N$43  (3 unrouted)
N$44  (1 unrouted)
N$45  (2 unrouted)
N$46  (2 unrouted)
N$47  (1 unrouted)
N$48  (5 unrouted)
N$49  (2 unrouted)
N$50  (1 unrouted)
N$51  (1 unrouted)
N$52  (2 unrouted)
N$53  (3 unrouted)
N$54  (1 unrouted)
N$55  (2 unrouted)
N$56  (1 unrouted)
N$57  (1 unrouted)
N$58  (1 unrouted)
N$59  (1 unrouted)
RAMP_CLK  (2 unrouted)
RAMP_VOLTAGE_INDICATOR  (1 unrouted)
TWG_OUT  (3 unrouted)
TWG_RAW  (3 unrouted)
V+  (via drill 0.3)  (9 unrouted)
  Top 0.406: C49.1 | 17.72,36.41 17.72,36.26 18.1,35.88 19.88,35.88 20.32,36.32 U2.7 | 20.32,45.66 20,45.34 C53.1 C55.1 v15.88,46.67 | 10.79,43.18 11.11,43.5 C5.1 v13.84,42.48
  Top 0.813: v13.84,42.48 17.72,38.61 C50.1 17.72,36.41 18.1,36.03 v18.1,34.61
  Bottom 0.813: v15.88,46.67 15.88,44.51 v13.84,42.48 13.78,42.42 7.3,42.42 5.02,44.7 5.02,48.58 5.97,49.53 7.94,49.53 8.57,50.16 | v20,28.57 20,32.7 v18.1,34.61
V-  (via drill 0.3)  (7 unrouted)
  Top 0.305: 24.5,32.31 C51.2
  Top 0.406: U2.4 24.5,32.31 | C54.2 C56.2 | 23.87,21.27 24.26,21.27 | 8.25,47.05 C6.2 | C51.2 24.51,31.37 v25.08,30.8 | 22.86,43.24 23.18,43.56
  Top 0.813: 23.18,43.56 C54.2 v24.45,42.23 | C6.2 v6.6,48.32 | 24.26,21.27 C52.2 v25.15,19.68
  Bottom 0.813: v6.6,48.32 21.89,48.32 21.91,48.46 21.91,44.77 v24.45,42.23 25.08,41.59 v25.08,30.8 25.15,30.73 v25.15,19.68
VOUT2  (2 unrouted)
VPP  (1 unrouted)

### Text on the board
tPlace: + 0 - | + 0 - | Iout | gnd | Iout | gnd | Iout | gnd | gnd | CCM_0009 / Precision Bipolar Current Driver (x3) / N. Fitch / Aug. 2017